# EAGLE design NanoV3.3 (EAGLE 9.5.2)
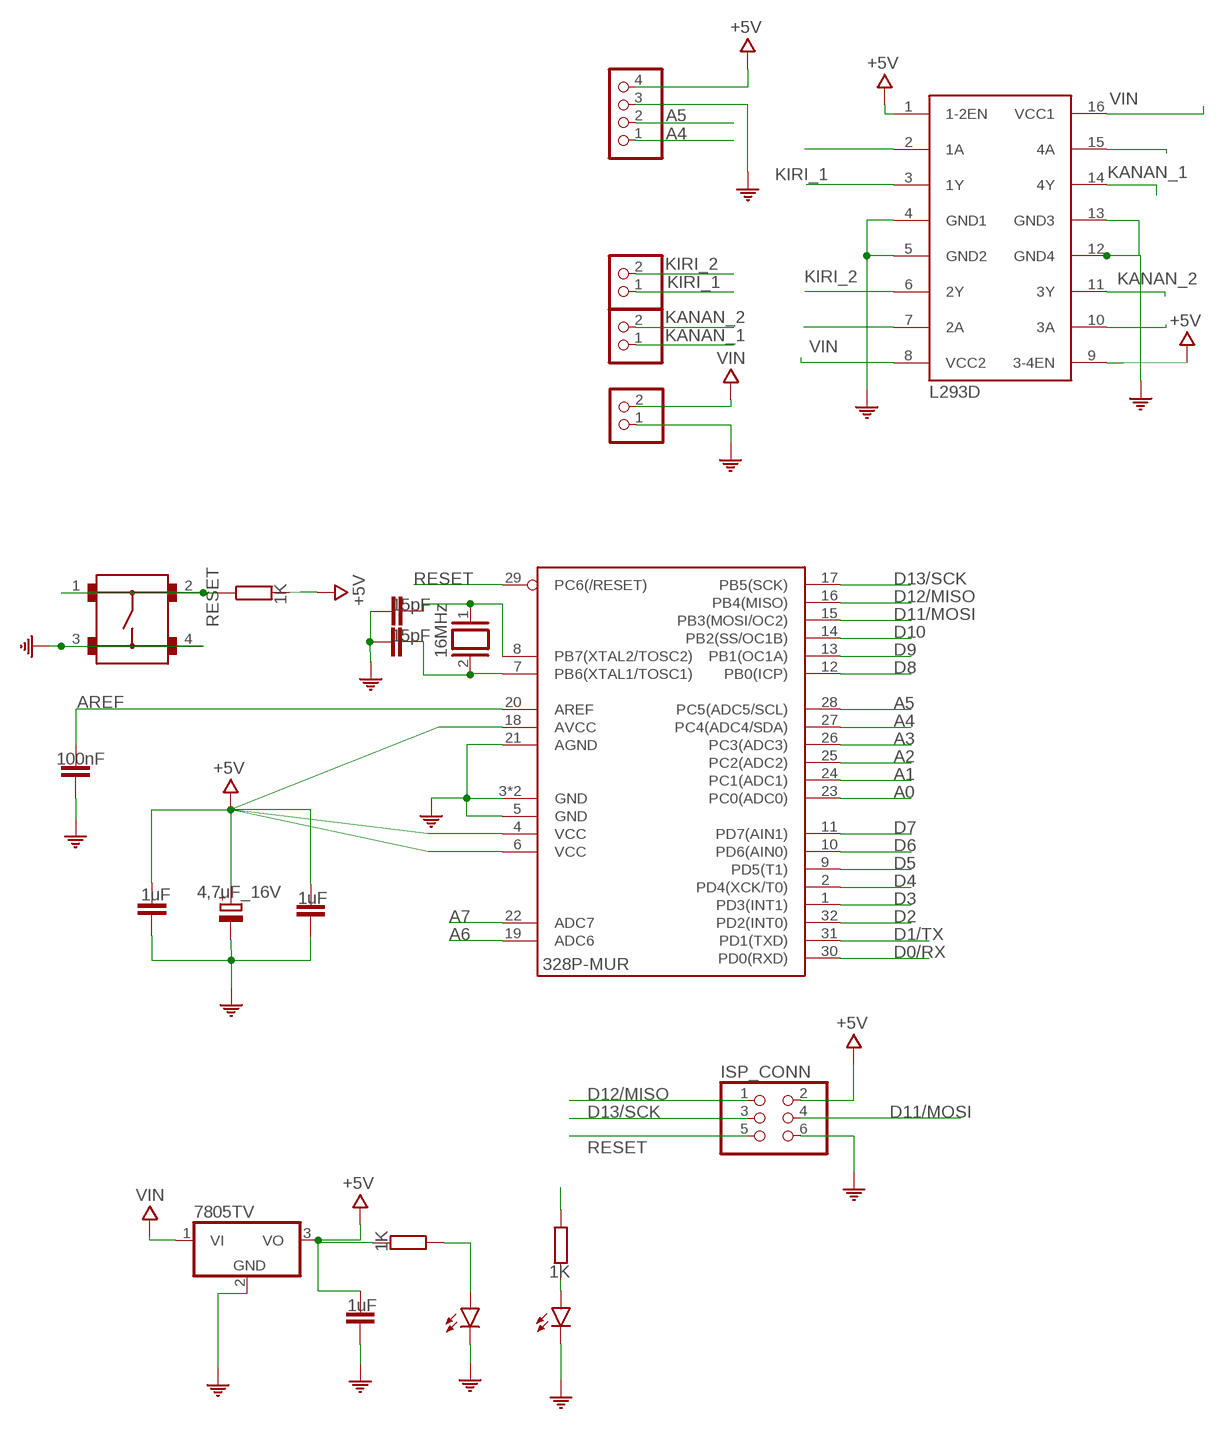
[diagram p0: schematic, sheet 1]

## Parts
C1  4,7uF_16V  CPOL-EUB45181A  [B45181A]
C2  15pF  C-EU025-024X044  [C025-024X044]
C3  1uF  C-EU025-024X044  [C025-024X044]
C4  15pF  C-EU025-024X044  [C025-024X044]
C6  100nF  C-EU025-024X044  [C025-024X044]
C9  1uF  C-EU025-024X044  [C025-024X044]
C10  1uF  C-EU025-024X044  [C025-024X044]
GYRO  PINHD-1X4  [1X04]
IC1  L293D  [DIL16]
IC3  328P-MUR  ATMEGA328P-32MUR  [VQFN32]
IC4  7805TV  [TO220V]
ISP_CONN  0114_PH254-203DF118A00V  [2X03]
J3  INPUT  PINHD-1X2  [1X02]
J6  MOTOR  PINHD-1X2  [1X02]
L  DATA  LED3MM  [LED3MM]
MOTOR  MOTOR  PINHD-1X2  [1X02]
PWR  POWER  LED3MM  [LED3MM]
Q1  16MHz  XTAL/S  [QS]
R1  1K  R-EU_0204/5  [0204/5]
R2  1K  R-EU_0204/5  [0204/5]
R3  1K  R-EU_0204/5  [0204/5]
SW1  RESET  B3F-1000  [B3F-1000]

## Nets
+5V: C1.+ C3.2 C9.2 C10.2 GYRO.4 IC1.1(1-2EN) IC1.9(3-4EN) IC3.4(VCC) IC3.6(VCC) IC3.18(AVCC) IC4.3(VO) ISP_CONN.2 R1.2 R2.2
A0: IC3.23(PC0(ADC0))
A1: IC3.24(PC1(ADC1))
A2: IC3.25(PC2(ADC2))
A3: IC3.26(PC3(ADC3))
A4: GYRO.1 IC3.27(PC4(ADC4/SDA))
A5: GYRO.2 IC3.28(PC5(ADC5/SCL))
A6: IC3.19(ADC6)
A7: IC3.22(ADC7)
AREF: C6.1 IC3.20(AREF)
COM: C1.- C2.1 C3.1 C4.1 C6.2 C9.1 C10.1 GYRO.3 IC1.4(GND1) IC1.5(GND2) IC1.12(GND4) IC1.13(GND3) IC3.3(GND) IC3.5(GND) IC3.21(AGND) IC3.33(GND) IC4.2(GND) ISP_CONN.6 J3.1 L.K(C) PWR.K(C) SW1.3 SW1.4
D0/RX: IC3.30(PD0(RXD))
D1/TX: IC3.31(PD1(TXD))
D2: IC3.32(PD2(INT0))
D3: IC3.1(PD3(INT1))
D4: IC3.2(PD4(XCK/T0))
D5: IC3.9(PD5(T1))
D6: IC1.2(1A) IC3.10(PD6(AIN0))
D7: IC3.11(PD7(AIN1))
D8: IC3.12(PB0(ICP))
D9: IC1.7(2A) IC3.13(PB1(OC1A))
D10: IC1.10(3A) IC3.14(PB2(SS/OC1B))
D11/MOSI: IC1.15(4A) IC3.15(PB3(MOSI/OC2)) ISP_CONN.4
D12/MISO: IC3.16(PB4(MISO)) ISP_CONN.1
D13/SCK: IC3.17(PB5(SCK)) ISP_CONN.3 R3.1
KANAN_1: IC1.14(4Y) J6.1
KANAN_2: IC1.11(3Y) J6.2
KIRI_1: IC1.3(1Y) MOTOR.1
KIRI_2: IC1.6(2Y) MOTOR.2
N$1: C4.2 IC3.7(PB6(XTAL1/TOSC1)) Q1.2
N$2: C2.2 IC3.8(PB7(XTAL2/TOSC2)) Q1.1
N$4: PWR.A R2.1
N$5: L.A R3.2
RESET: IC3.29(PC6(/RESET)) ISP_CONN.5 R1.1 SW1.1 SW1.2
VIN: IC1.8(VCC2) IC1.16(VCC1) IC4.1(VI) J3.2

## Library data of the parts
C1 = rcl:CPOL-EU: POLARIZED CAPACITOR, European symbol; SPICEPREFIX: C
C2-C4 C6 C9 C10 = rcl:C-EU: CAPACITOR, European symbol; SPICEPREFIX: C
GYRO = pinhead:PINHD-1X4: PIN HEADER
IC1 = st-microelectronics:L293D: PUSH-PULL 4 CHANNEL DRIVER; MPN: L293D; OC_FARNELL: 9589619; OC_NEWARK: 56P8249
IC3 = Arduino-ucs&SoCs:ATMEGA328P-32: 8-bit Microcontroller with 32KBytes In-System Programmable Flash ATMEGA328P-AU; DATASHEET: http://www.atmel.com/images/Atmel-8271-8-bit-AVR-Microcontroller-ATmega48A-48PA-88A-88PA-168A-168PA-328-328P_datasheet_Complete.pdf; DISTRIBUTOR-LINK: https://www.digikey.it/product-detail/it/microchip-technology/ATMEGA328P-MUR/ATMEGA328P-MURCT-ND/3440953; DISTRIBUTOR-PN: ATMEGA328P-MURCT-ND; MANUFACTURER: ATMEL; MANUFACTURER-PN: ATMEGA328P-MUR
IC4 = linear:78*: Positive VOLTAGE REGULATOR Source: http://cache.national.com/ds/LM/LM78L05.pdf http://www.fairchildsemi.com/ds/LM/LM7805.pdf
ISP_CONN = Connettori:0114_PH254-203DF118A00V: 3x2 M V h 8,5 mm p2,54; MONTHLY_USAGE: _____; PART_NUMBER: PH254-203DF118A00V; PRICE: _____; SUPPLIER: _____; TYPE: Connettori; VALUE: ICSP
J3 J6 MOTOR = pinhead:PINHD-1X2: PIN HEADER
L PWR = led:LED: LED OSRAM: - CHIPLED LG R971, LG N971, LY N971, LG Q971, LY Q971, LO R971, LY R971 LH N974, LH R974 LS Q976, LO Q976, LY Q976 LO Q996 - Hyper CHIPLED LW Q18S LB Q993, LB Q99A, LB R99A - SideLED LS A670, LO A670, LY A670, LG A670, LP A670 LB A673, LV A673, LT A673, LW A673 LH A674 LY A675 LS A676, LA A676, LO A676, LY A676, LW A676 LS A679, LY A679, LG A679 - Hyper Micro SIDELED® LS Y876, LA Y876, LO Y876, LY Y876 LT Y87S - SmartLED LW L88C, LW L88S LB L89C, LB L89S, LG L890 LS L89K, LO L89K, LY L89K LS L896, LA L896, LO L896, LY L896 - TOPLED LS T670, LO T670, LY T670, LG T670, LP T670 LSG T670, LSP T670, LSY T670, LOP T670, LYG T670 LG T671, LOG T671, LSG T671 LB T673, LV T673, LT T673, LW T673 LH T674 LS T676, LA T676, LO T676, LY T676, LB T676, LH T676, LSB T676, LW T676 LB T67C, LV T67C, LT T67C, LS T67K, LO T67K, LY T67K, LW E67C LS E67B, LA E67B, LO E67B, LY E67B, LB E67C, LV E67C, LT E67C LW T67C LS T679, LY T679, LG T679 LS T770, LO T770, LY T770, LG T770, LP T770 LB T773, LV T773, LT T773, LW T773 LH T774 LS E675, LA E675, LY E675, LS T675 LS T776, LA T776, LO T776, LY T776, LB T776 LHGB T686 LT T68C, LB T68C - Hyper Mini TOPLED® LB M676 - Mini TOPLED Santana® LG M470 LS M47K, LO M47K, LY M47K Source: http://www.osram.convergy.de LUXEON: - LUMILED® LXK2-PW12-R00, LXK2-PW12-S00, LXK2-PW14-U00, LXK2-PW14-V00 LXK2-PM12-R00, LXK2-PM12-S00, LXK2-PM14-U00 LXK2-PE12-Q00, LXK2-PE12-R00, LXK2-PE12-S00, LXK2-PE14-T00, LXK2-PE14-U00 LXK2-PB12-K00, LXK2-PB12-L00, LXK2-PB12-M00, LXK2-PB14-N00, LXK2-PB14-P00, LXK2-PB14-Q00 LXK2-PR12-L00, LXK2-PR12-M00, LXK2-PR14-Q00, LXK2-PR14-R00 LXK2-PD12-Q00, LXK2-PD12-R00, LXK2-PD12-S00 LXK2-PH12-R00, LXK2-PH12-S00 LXK2-PL12-P00, LXK2-PL12-Q00, LXK2-PL12-R00 Source: www.luxeon.com KINGBRIGHT: KA-3528ASYC Source: www.kingbright.com
Q1 = special:XTAL/S: CRYSTAL
R1-R3 = resistor:R-EU_: RESISTOR, European symbol
SW1 = Switch:B3F-1000: Tactile Switch SPST-NO Top Actuated Through Hole Manufacturer's datasheet <https://omronfs.omron.com/en_US/ecb/products/pdf/en-b3f.pdf>; CREATED_BY: PCBLayout.com; DIGI_KEY_PART_NUMBER: SW400-ND; MANUFACTURER: Omron Electronics Inc-EMC Div; MPN: B3F-1000; PACKAGE: SPST-NO

## Board
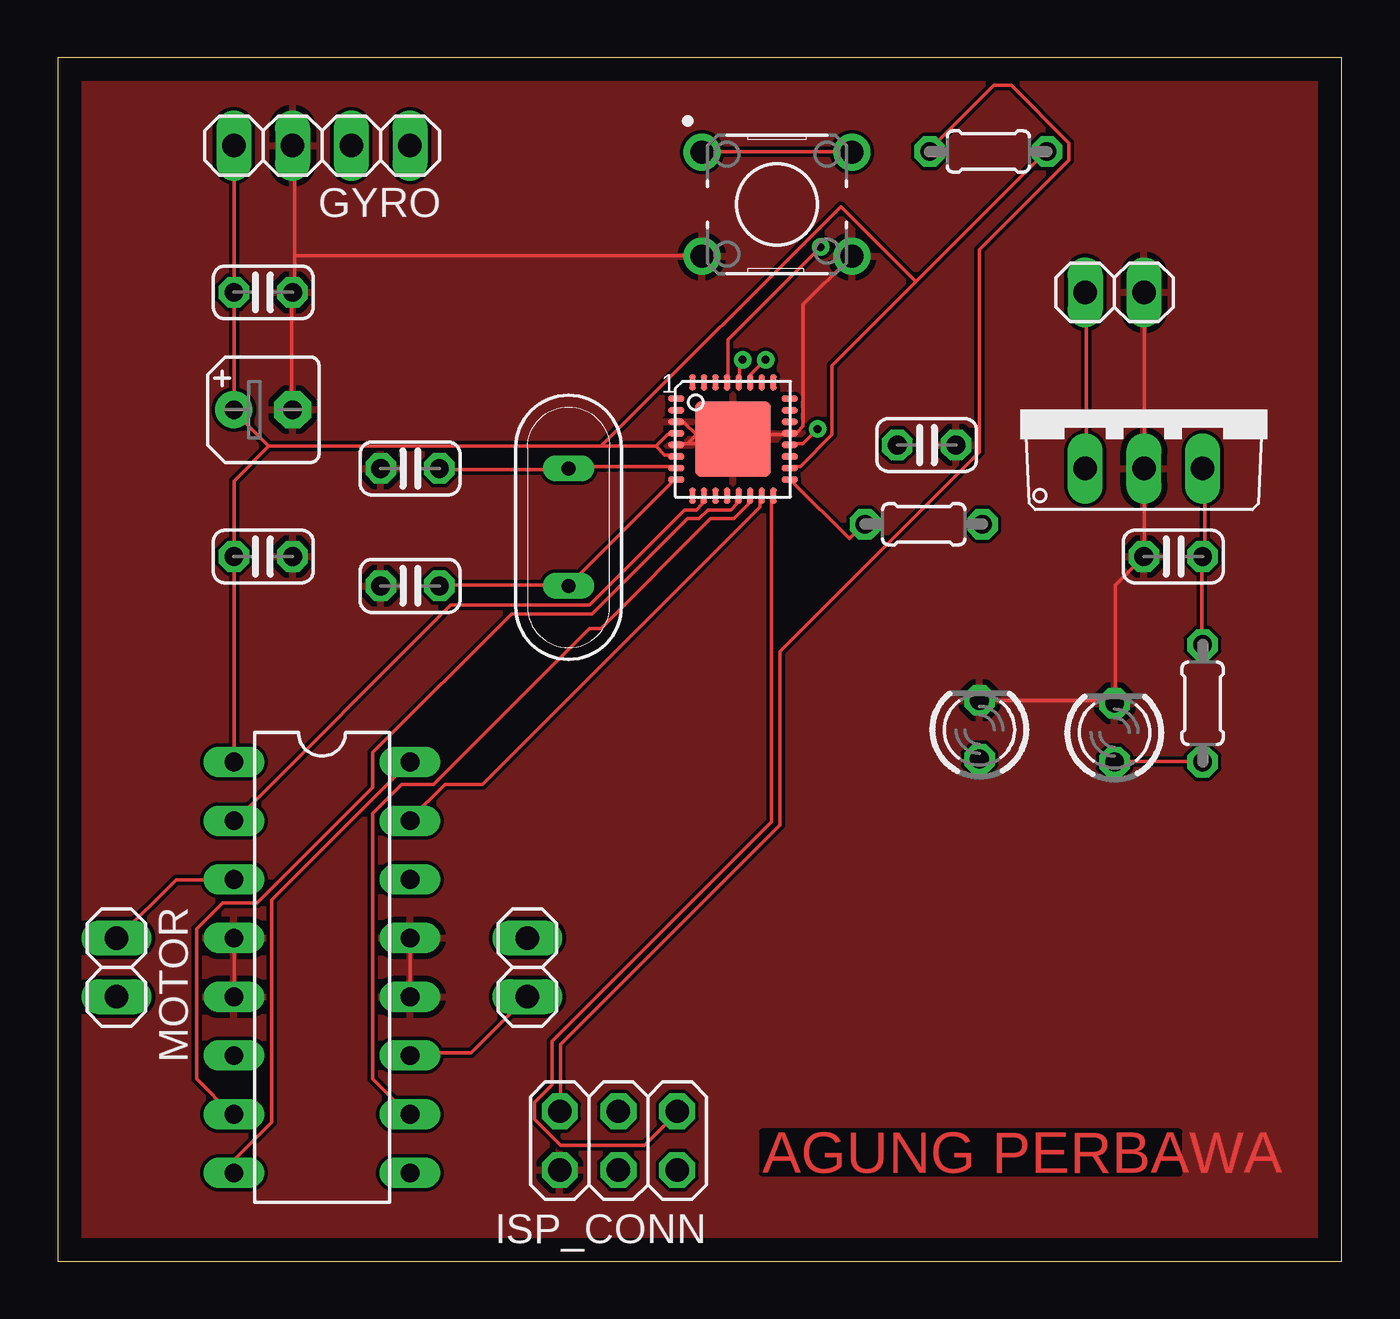
[diagram p1: board, top side]
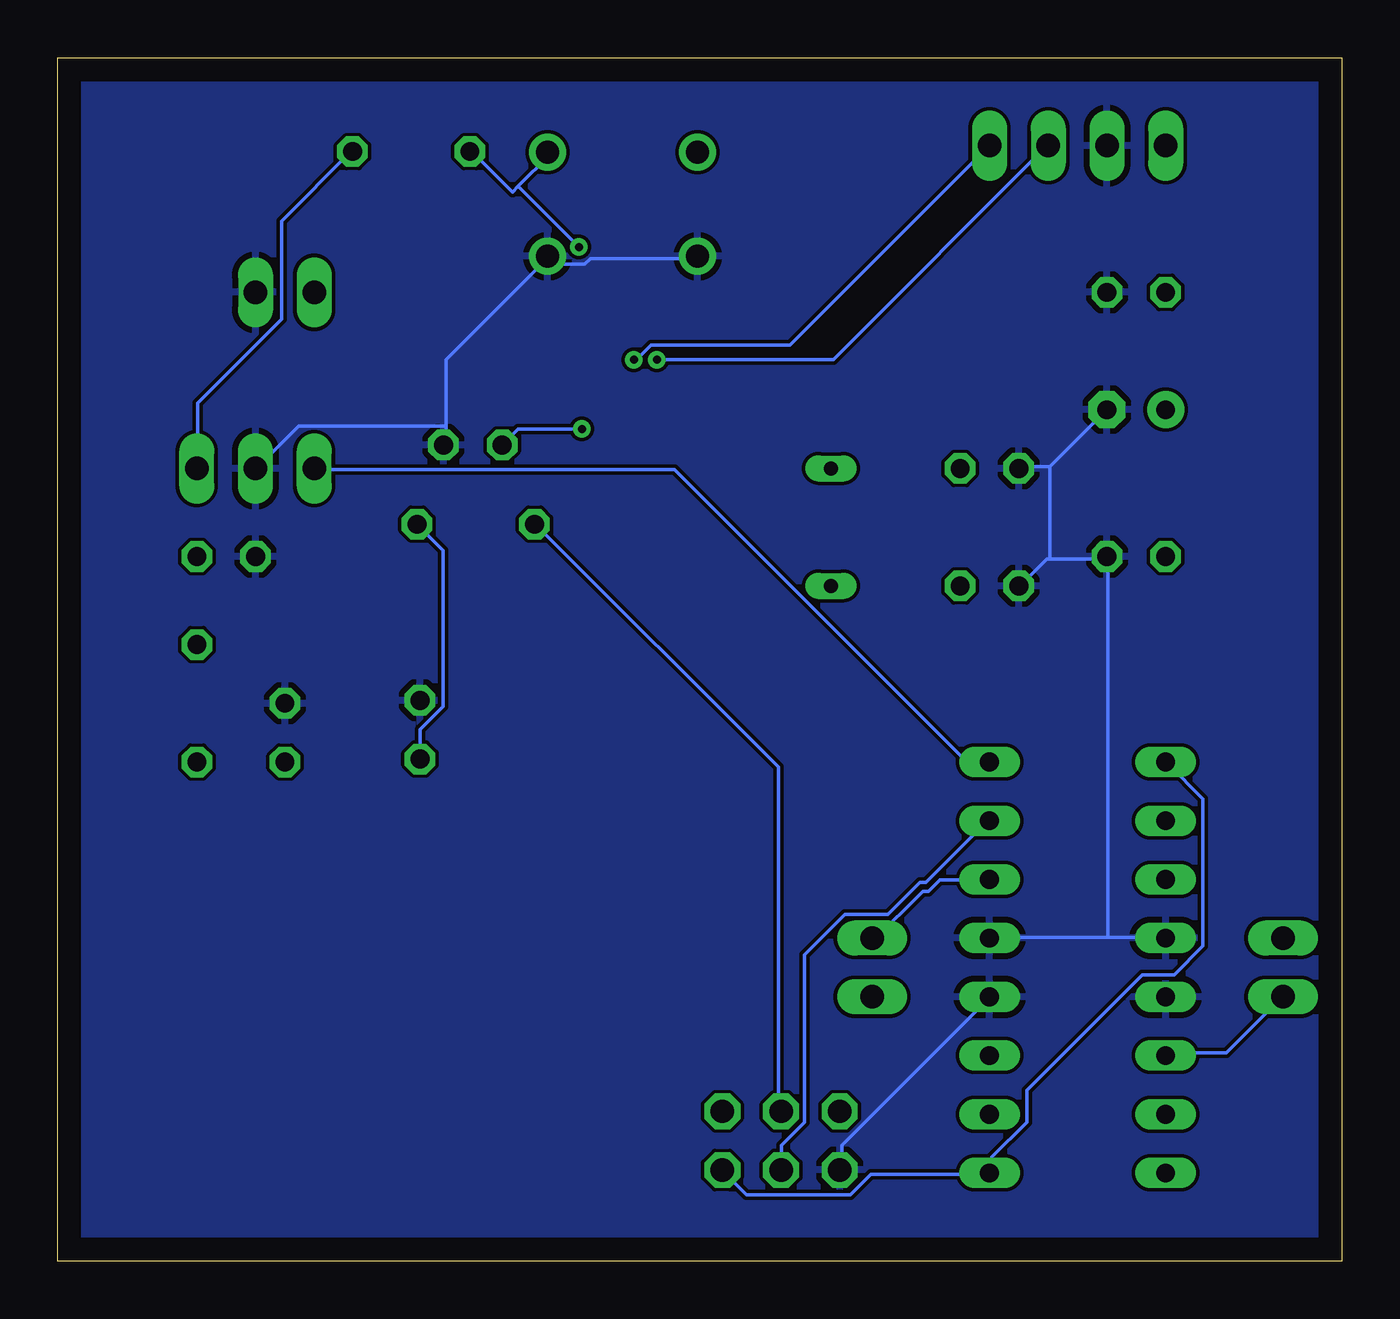
[diagram p2: board, bottom side, seen from below]

Size 55.55 x 52.06 mm. Coordinates in mm from the lower left corner, seen from the top.
Outline: 0,0 55.55,0 55.55,52.06 0,52.06 0,0
Copper layers (1*16): Top 0.035mm / dielectric 1.5mm / Bottom 0.035mm
Design rules "default": minimum track width 6mil, minimum drill 0.35mm, track to track 6mil, track to pad 6mil, pad to pad 6mil, via to via 6mil, smd to smd 6mil, copper to edge 40mil, drill to drill 6mil, minimum pad ring 10mil, minimum via ring 8mil, stop-mask expansion 4mil, vias tented up to drill 0mil, thermal gap 10mil

### Footprints (pad centres in the part's own frame; a part is rotated, then mirrored left to right if it is on the bottom)
B45181A = drill 0.813 pad 1.6: + -1.27,0 | drill 0.813 pad 1.6 octagon: - 1.27,0
C025-024X044 = drill 0.813 octagon: 1 -1.27,0; 2 1.27,0
1X04 = drill 1.016 long: 1 -3.81,0; 2 -1.27,0; 3 1.27,0; 4 3.81,0
DIL16 = drill 0.813 long: 1 -8.89,-3.81; 2 -6.35,-3.81; 3 -3.81,-3.81; 4 -1.27,-3.81; 5 1.27,-3.81; 6 3.81,-3.81; 7 6.35,-3.81; 8 8.89,-3.81; 9 8.89,3.81; 10 6.35,3.81; 11 3.81,3.81; 12 1.27,3.81; 13 -1.27,3.81; 14 -3.81,3.81; 15 -6.35,3.81; 16 -8.89,3.81
VQFN32 = smd 0.7 x 0.28: 1 -2.45,1.75; 2 -2.45,1.25; 3 -2.45,0.75; 4 -2.45,0.25; 5 -2.45,-0.25; 6 -2.45,-0.75; 7 -2.45,-1.25; 8 -2.45,-1.75; 17 2.45,-1.75; 18 2.45,-1.25; 19 2.45,-0.75; 20 2.45,-0.25; 21 2.45,0.25; 22 2.45,0.75; 23 2.45,1.25; 24 2.45,1.75 | smd 0.28 x 0.7: 9 -1.75,-2.45; 10 -1.25,-2.45; 11 -0.75,-2.45; 12 -0.25,-2.45; 13 0.25,-2.45; 14 0.75,-2.45; 15 1.25,-2.45; 16 1.75,-2.45; 25 1.75,2.45; 26 1.25,2.45; 27 0.75,2.45; 28 0.25,2.45; 29 -0.25,2.45; 30 -0.75,2.45; 31 -1.25,2.45; 32 -1.75,2.45 | smd 3.254 x 3.254: 33 0,0
TO220V = drill 1.016 long: 1 -2.54,-2.54; 2 0,-2.54; 3 2.54,-2.54
2X03 = drill 1.016 pad 1.55 octagon: 1 -2.54,-1.27; 2 -2.54,1.27; 3 0,-1.27; 4 0,1.27; 5 2.54,-1.27; 6 2.54,1.27
1X02 = drill 1.016 long: 1 -1.27,0; 2 1.27,0
LED3MM = drill 0.813 octagon: A -1.27,0; K 1.27,0
QS = drill 0.61 long: 1 -2.54,0; 2 2.54,0
0204/5 = drill 0.813 octagon: 1 -2.54,0; 2 2.54,0
B3F-1000 = drill 1 pad 1.6: 1 -3.25,2.25; 2 3.25,2.25; 3 -3.25,-2.25; 4 3.25,-2.25

### Placement (x,y rotation side)
C1  8.89,36.83 0 top
C2  15.24,29.21 0 top
C3  48.26,30.48 0 top
C4  15.24,34.29 0 top
C6  37.59,35.31 0 top
C9  8.89,30.48 180 top
C10  8.89,41.91 180 top
GYRO  11.43,48.26 180 top
IC1  11.43,12.7 270 top
IC3  29.21,35.56 0 top
IC4  46.99,36.83 0 top
ISP_CONN  24.26,5.21 180 top
J3  45.72,41.91 180 top
J6  20.32,12.7 270 top
L  39.88,22.99 90 top
MOTOR  2.54,12.7 270 top
PWR  45.72,22.86 90 top
Q1  22.1,31.75 90 top
R1  40.26,48.01 0 top
R2  49.53,24.13 90 top
R3  37.47,31.88 0 top
SW1  31.11,45.72 0 top

### Tracks (layer width: path | path; a pad name or v marks a point on that pad's centre or on a via)
+5V
  Top 0.152: R2.2 49.5,26.75 49.5,30.38 C3.2 49.62,30.5 49.62,34.25 IC4.3 | 37.12,42.38 42.75,48 R1.2 | 37.12,42.38 33.5,38.75 33.5,35.75 32.12,34.38 31.75,34.38 IC3.18 | IC1.1 7.62,21.62 7.62,30.38 C9.2 7.62,30.5 7.62,33.75 9.12,35.25 | 25.88,35.25 26.25,34.88 26.75,34.88 IC3.6 | 25.88,35.25 26.38,35.75 26.75,35.75 IC3.4 | 9.12,35.25 23.5,35.25 | 23.5,35.25 25.88,35.25 | 9.12,35.25 7.62,36.75 C1.+ 7.62,36.88 7.62,41.88 C10.2 7.62,42 GYRO.4 | 37.12,42.38 33.88,45.62 23.5,35.25
  Bottom 0.152: IC4.3 49.5,34.38 49.5,37.12 45.88,40.75 45.88,45 42.88,48 R1.2 | ISP_CONN.2 26.75,3.88 25.75,2.88 21.25,2.88 20.38,3.75 15.25,3.75 IC1.9 15.12,3.88 15.12,4.5 13.62,6 13.62,7.38 8.62,12.38 7.25,12.38 6,13.62 6,20 7.5,21.5 IC1.1
A4  (via drill 0.35)
  Top 0.152: v30.62,39 30,38.38 30,38.12 IC3.27
  Bottom 0.152: v30.62,39 30.5,39 29.88,39.62 23.88,39.62 GYRO.1
A5  (via drill 0.35)
  Top 0.152: v29.62,39 29.5,38.88 29.5,38.12 IC3.28
  Bottom 0.152: v29.62,39 22,39 12.75,48.25 GYRO.2
AREF  (via drill 0.35)
  Top 0.152: v32.88,36 32.25,35.38 31.75,35.38 IC3.20
  Bottom 0.152: v32.88,36 35.62,36 36.25,35.38 C6.1
COM
  Top 0.152: 27.25,35.38 29,35.38 29.12,35.5 IC3.33 29.25,35.62 29.38,35.75 31.62,35.75 IC3.21 31.75,35.88 32,35.88 32.25,36.12 32.25,41.38 34.25,43.38 SW1.4 | 27.25,35.38 26.88,35.38 IC3.5 | 27.25,35.38 27.62,35.75 27.12,36.25 26.88,36.25 IC3.3 | L.K 40,24.25 45.62,24.25 PWR.K 45.75,24.25 45.75,29.25 46.88,30.38 C3.1 47,30.5 47,34.25 IC4.2 47,34.38 47,41.88 J3.1 | C1.- 10.12,36.88 10.12,41.88 C10.1 10.25,42 10.25,43.5 | 10.25,43.5 10.25,48.25 GYRO.3 | IC1.5 7.62,11.5 7.62,13.88 IC1.4 | IC1.12 15.25,11.5 15.25,13.88 IC1.13 | 10.25,43.5 27.75,43.5 SW1.3
  Bottom 0.152: 38.75,36.12 38.75,39 34.62,43.12 | 38.75,36.12 38.75,35.38 C6.2 | 34.62,43.12 34.38,43.38 SW1.4 34.62,43.12 | 34.62,43.12 32.75,43.12 32.5,43.38 27.88,43.38 SW1.3 | 38.75,36.12 45.12,36.12 46.88,34.38 IC4.2 | 12.62,30.38 12.75,30.38 13.88,29.25 C2.1 | 12.62,30.38 10.25,30.38 C9.1 10.12,30.38 10.12,14 | 12.62,34.38 13.88,34.38 C4.1 | 12.62,34.38 10.25,36.75 C1.- | 12.62,34.38 12.62,30.38 | ISP_CONN.6 21.62,4 21.62,5 15.25,11.38 IC1.12 | 10.12,14 15.12,14 IC1.13 | 10.12,14 7.62,14 IC1.4
  pour Top: -4,54 -4,-4 60,-4 60,56 -4,56
  pour Bottom: -4,56 60,56 60,-4 -2,-4 -4,-4
D6
  Top 0.152: IC3.10 27.88,33 27.88,32.75 27.62,32.5 27.12,32.5 23,28.38 17,28.38 7.62,19 IC1.2
D9
  Top 0.152: IC3.13 29.38,33 29.38,32.75 29.12,32.5 28.12,32.5 27.75,32.12 27.25,32.12 23.12,28 19.62,28 13.62,22 13.62,20.5 8.62,15.5 7.12,15.5 6,14.38 6,7.88 7.5,6.38 IC1.7
D10
  Top 0.152: IC3.14 29.88,33 29.88,32.75 29.25,32.12 28.25,32.12 23.5,27.38 23,27.38 16.25,20.62 14.88,20.62 13.62,19.38 13.62,7.88 15.12,6.38 IC1.10
D11/MOSI
  Top 0.152: IC3.15 30.38,33 30.38,32.62 18.38,20.62 16.75,20.62 15.25,19.12 IC1.15
  Bottom 0.152: ISP_CONN.4 24.25,4 24.25,5 23.25,6 23.25,13.25 21.5,15 19.62,15 18.25,16.38 18,16.38 15.25,19.12 IC1.15
D12/MISO
  Top 0.152: IC3.16 30.88,33 30.88,19 21.38,9.5 21.38,7.62 20.62,6.88 20.62,6.12 21.75,5 25.38,5 26.75,6.38 ISP_CONN.1
D13/SCK
  Top 0.152: IC3.17 31.75,33.75 34.25,31.25 34.88,31.88 R3.1
  Bottom 0.152: ISP_CONN.3 24.38,6.5 24.38,21.38 34.88,31.88 R3.1
KANAN_1
  Bottom 0.152: IC1.14 17.38,16.5 17.88,16 18.12,16 20.25,13.88 J6.1
KANAN_2
  Top 0.152: IC1.11 15.25,9 17.88,9 20.25,11.38 J6.2
KIRI_1
  Top 0.152: IC1.3 7.5,16.5 5.12,16.5 2.62,14 MOTOR.1
KIRI_2
  Bottom 0.152: IC1.6 7.5,9 5,9 2.62,11.38 MOTOR.2
N$1
  Top 0.152: IC3.7 26.75,34.38 22.12,34.38 Q1.2 22,34.25 16.62,34.25 C4.2
N$2
  Top 0.152: IC3.8 26.75,33.75 26.62,33.75 22.12,29.25 Q1.1 22,29.25 16.62,29.25 C2.2
N$4
  Top 0.152: PWR.A 45.75,21.62 49.5,21.62 R2.1
N$5
  Bottom 0.152: L.A 39.88,21.75 39.88,23 38.88,24 38.88,30.75 R3.2
RESET  (via drill 0.35)
  Top 0.152: v33,43.88 29,39.88 29,38.12 IC3.29 | ISP_CONN.5 21.75,6.5 21.75,9.38 31.25,18.88 31.25,26.38 39.88,35 39.88,43.75 43.75,47.62 43.75,48.38 41.25,50.88 40.5,50.88 37.75,48.12 R1.1 | SW1.1 27.88,48 34.25,48 SW1.2
  Bottom 0.152: 35.62,46.5 v33,43.88 | 35.62,46.5 34.25,47.88 SW1.2 | 35.62,46.5 35.88,46.25 37.62,48 R1.1
VIN
  Top 0.152: IC4.1 44.5,34.38 44.5,41.88 J3.2 | IC1.8 7.62,3.88 7.62,4.38 9.25,6 9.25,15.62 15.12,21.5 IC1.16
  Bottom 0.152: IC4.1 44.38,34.25 28.88,34.25 15.75,21.12 15.25,21.62 IC1.16

### Text on the board
Top: AGUNG PERBAWA